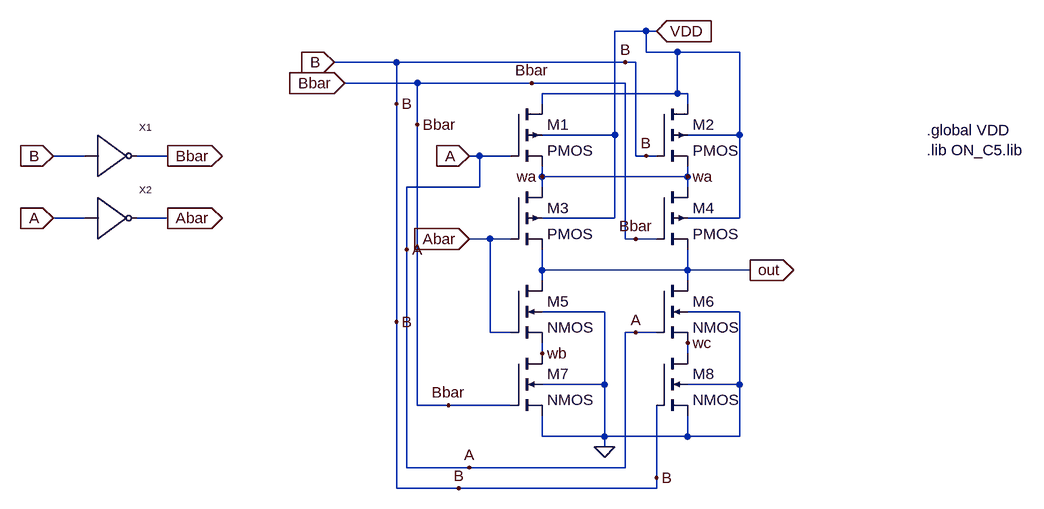
[diagram p0: schematic xor_1.asc]
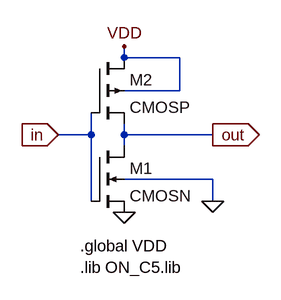
[diagram p1: sub-circuit inverter.asc]
xor_1.asc, the LTspice schematic file:
Version 4
SHEET 1 880 680
WIRE 144 -464 96 -464
WIRE 160 -464 144 -464
WIRE 144 -432 144 -464
WIRE 192 -432 144 -432
WIRE 288 -432 192 -432
WIRE -240 -416 -336 -416
WIRE 112 -416 -240 -416
WIRE 128 -416 112 -416
WIRE -208 -384 -320 -384
WIRE -32 -384 -208 -384
WIRE 112 -384 -32 -384
WIRE 192 -368 192 -432
WIRE 192 -368 -16 -368
WIRE 208 -368 192 -368
WIRE -240 -352 -240 -416
WIRE -16 -352 -16 -368
WIRE 208 -352 208 -368
WIRE -208 -320 -208 -384
WIRE 96 -304 96 -464
WIRE 96 -304 -16 -304
WIRE 288 -304 288 -432
WIRE 288 -304 208 -304
WIRE -720 -272 -768 -272
WIRE -592 -272 -640 -272
WIRE -112 -272 -128 -272
WIRE -64 -272 -112 -272
WIRE 128 -272 128 -416
WIRE 144 -272 128 -272
WIRE 160 -272 144 -272
WIRE -16 -240 -16 -256
WIRE 208 -240 208 -256
WIRE 208 -240 -16 -240
WIRE -112 -224 -112 -272
WIRE -112 -224 -224 -224
WIRE -16 -224 -16 -240
WIRE 208 -224 208 -240
WIRE -720 -176 -768 -176
WIRE -592 -176 -640 -176
WIRE 96 -176 96 -304
WIRE 96 -176 -16 -176
WIRE 288 -176 288 -304
WIRE 288 -176 208 -176
WIRE -96 -144 -128 -144
WIRE -64 -144 -96 -144
WIRE 112 -144 112 -384
WIRE 128 -144 112 -144
WIRE 160 -144 128 -144
WIRE -224 -128 -224 -224
WIRE -16 -96 -16 -128
WIRE 208 -96 208 -128
WIRE 208 -96 -16 -96
WIRE 304 -96 208 -96
WIRE -16 -80 -16 -96
WIRE 208 -80 208 -96
WIRE 80 -32 -16 -32
WIRE 288 -32 208 -32
WIRE -240 -16 -240 -352
WIRE -96 0 -96 -144
WIRE -64 0 -96 0
WIRE 128 0 112 0
WIRE 160 0 128 0
WIRE -16 32 -16 16
WIRE 208 32 208 16
WIRE 80 80 80 -32
WIRE 80 80 -16 80
WIRE 288 80 288 -32
WIRE 288 80 208 80
WIRE -208 112 -208 -320
WIRE -160 112 -208 112
WIRE -64 112 -160 112
WIRE -16 160 -16 128
WIRE 80 160 80 80
WIRE 80 160 -16 160
WIRE 208 160 208 128
WIRE 208 160 80 160
WIRE 288 160 288 80
WIRE 288 160 208 160
WIRE 80 176 80 160
WIRE -224 208 -224 -128
WIRE -128 208 -224 208
WIRE 112 208 112 0
WIRE 112 208 -128 208
WIRE 160 224 160 112
WIRE -240 240 -240 -16
WIRE -144 240 -240 240
WIRE 160 240 160 224
WIRE 160 240 -144 240
FLAG -128 -272 A
IOPIN -128 -272 In
FLAG -336 -416 B
IOPIN -336 -416 In
FLAG -320 -384 Bbar
IOPIN -320 -384 In
FLAG -128 -144 Abar
IOPIN -128 -144 In
FLAG 80 176 0
FLAG 304 -96 out
IOPIN 304 -96 Out
FLAG -768 -272 B
IOPIN -768 -272 In
FLAG -592 -272 Bbar
IOPIN -592 -272 Out
FLAG -768 -176 A
IOPIN -768 -176 In
FLAG -592 -176 Abar
IOPIN -592 -176 Out
FLAG 160 -464 VDD
IOPIN 160 -464 In
FLAG -128 208 A
FLAG 128 0 A
FLAG -224 -128 A
FLAG -160 112 Bbar
FLAG -208 -320 Bbar
FLAG 160 224 B
FLAG -144 240 B
FLAG -240 -16 B
FLAG -240 -352 B
FLAG 112 -416 B
FLAG 144 -272 B
FLAG 128 -144 Bbar
FLAG -32 -384 Bbar
FLAG -16 32 wb
FLAG 208 16 wc
FLAG -16 -240 wa
FLAG 208 -240 wa
SYMBOL pmos4 -64 -352 R0
SYMATTR InstName M1
SYMBOL pmos4 160 -352 R0
SYMATTR InstName M2
SYMBOL pmos4 -64 -224 R0
SYMATTR InstName M3
SYMBOL pmos4 160 -224 R0
SYMATTR InstName M4
SYMBOL nmos4 -64 -80 R0
SYMATTR InstName M5
SYMBOL nmos4 160 -80 R0
SYMATTR InstName M6
SYMBOL nmos4 -64 32 R0
SYMATTR InstName M7
SYMBOL nmos4 160 32 R0
SYMATTR InstName M8
SYMBOL inverter -688 -272 R0
SYMATTR InstName X1
SYMBOL inverter -688 -176 R0
SYMATTR InstName X2
TEXT 576 -312 Left 2 !.global VDD\n.lib ON_C5.lib

inverter.asc, the sub-circuit schematic file:
Version 4
SHEET 1 900 680
WIRE 160 112 160 96
WIRE 240 112 160 112
WIRE 240 160 240 112
WIRE 240 160 160 160
WIRE 112 224 112 192
WIRE 112 224 64 224
WIRE 160 224 160 208
WIRE 288 224 160 224
WIRE 160 240 160 224
WIRE 288 288 160 288
WIRE 112 320 112 224
WIRE 288 320 288 288
FLAG 288 224 out
IOPIN 288 224 Out
FLAG 64 224 in
IOPIN 64 224 In
FLAG 160 336 0
FLAG 288 320 0
FLAG 160 96 VDD
SYMBOL nmos4 112 240 R0
SYMATTR InstName M1
SYMATTR Value CMOSN
SYMATTR Value2 l=0.6u w=0.9u
SYMBOL pmos4 112 112 R0
SYMATTR InstName M2
SYMATTR Value CMOSP
SYMATTR Value2 l=0.6u w=1.8u
TEXT 96 384 Left 2 !.global VDD\n.lib ON_C5.lib

The netlist it stands for:
* xor_1.asc
M1 VDD A wa VDD PMOS
M2 VDD B wa VDD PMOS
M3 wa Abar out VDD PMOS
M4 wa Bbar out VDD PMOS
M5 out Abar wb 0 NMOS
M6 out A wc 0 NMOS
M7 wb Bbar 0 0 NMOS
M8 wc B 0 0 NMOS
XX1 B Bbar inverter
XX2 A Abar inverter

* block symbol definitions
.subckt inverter in out
M1 out in 0 0 CMOSN l=0.6u w=0.9u
M2 VDD in out VDD CMOSP l=0.6u w=1.8u
.global VDD
.lib ON_C5.lib
.ends inverter

.model NMOS NMOS
.model PMOS PMOS
.lib standard.mos
.global VDD
.lib ON_C5.lib
.backanno
.end